# EAGLE design LED4BUS0805_v01 (EAGLE 6.5.0)
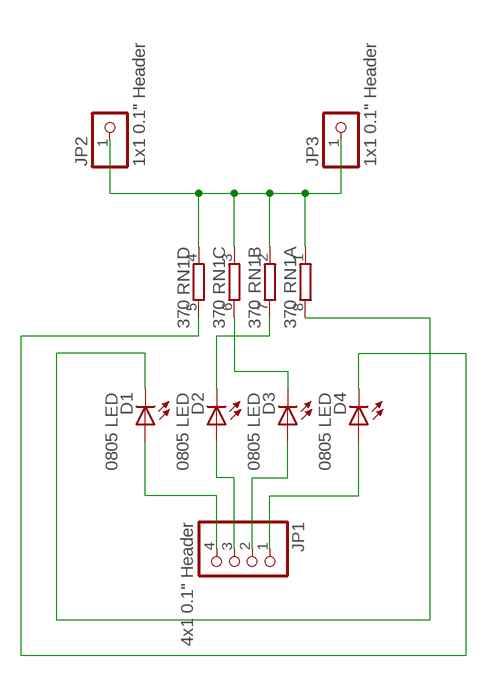
[diagram p0: schematic, sheet 1]

## Parts
D1  0805 LED  LEDCHIP-LED0805  [CHIP-LED0805]
D2  0805 LED  LEDCHIP-LED0805  [CHIP-LED0805]
D3  0805 LED  LEDCHIP-LED0805  [CHIP-LED0805]
D4  0805 LED  LEDCHIP-LED0805  [CHIP-LED0805]
JP1  4x1 0.1" Header  PINHD-1X4  [1X04]
JP2  1x1 0.1" Header  PINHD-1X1  [1X01]
JP3  1x1 0.1" Header  PINHD-1X1  [1X01]
RN1  370  4R-N0603-ARV  [0603-ARV]

## Nets
N$1: D2.A JP1.3
N$2: D3.A JP1.2
N$3: D4.A JP1.1
N$4: D1.A JP1.4
N$5: D3.C RN1.6
N$6: D2.C RN1.7
N$7: D4.C RN1.5
N$8: D1.C RN1.8
N$9: JP2.1 JP3.1 RN1.1 RN1.2 RN1.3 RN1.4

## Library data of the parts
D1-D4 = led:LED: LED OSRAM: - CHIPLED LG R971, LG N971, LY N971, LG Q971, LY Q971, LO R971, LY R971 LH N974, LH R974 LS Q976, LO Q976, LY Q976 LO Q996 - Hyper CHIPLED LW Q18S LB Q993, LB Q99A, LB R99A - SideLED LS A670, LO A670, LY A670, LG A670, LP A670 LB A673, LV A673, LT A673, LW A673 LH A674 LY A675 LS A676, LA A676, LO A676, LY A676, LW A676 LS A679, LY A679, LG A679 - Hyper Micro SIDELED® LS Y876, LA Y876, LO Y876, LY Y876 LT Y87S - SmartLED LW L88C, LW L88S LB L89C, LB L89S, LG L890 LS L89K, LO L89K, LY L89K LS L896, LA L896, LO L896, LY L896 - TOPLED LS T670, LO T670, LY T670, LG T670, LP T670 LSG T670, LSP T670, LSY T670, LOP T670, LYG T670 LG T671, LOG T671, LSG T671 LB T673, LV T673, LT T673, LW T673 LH T674 LS T676, LA T676, LO T676, LY T676, LB T676, LH T676, LSB T676, LW T676 LB T67C, LV T67C, LT T67C, LS T67K, LO T67K, LY T67K, LW E67C LS E67B, LA E67B, LO E67B, LY E67B, LB E67C, LV E67C, LT E67C LW T67C LS T679, LY T679, LG T679 LS T770, LO T770, LY T770, LG T770, LP T770 LB T773, LV T773, LT T773, LW T773 LH T774 LS E675, LA E675, LY E675, LS T675 LS T776, LA T776, LO T776, LY T776, LB T776 LHGB T686 LT T68C, LB T68C - Hyper Mini TOPLED® LB M676 - Mini TOPLED Santana® LG M470 LS M47K, LO M47K, LY M47K Source: http://www.osram.convergy.de LUXEON: - LUMILED® LXK2-PW12-R00, LXK2-PW12-S00, LXK2-PW14-U00, LXK2-PW14-V00 LXK2-PM12-R00, LXK2-PM12-S00, LXK2-PM14-U00 LXK2-PE12-Q00, LXK2-PE12-R00, LXK2-PE12-S00, LXK2-PE14-T00, LXK2-PE14-U00 LXK2-PB12-K00, LXK2-PB12-L00, LXK2-PB12-M00, LXK2-PB14-N00, LXK2-PB14-P00, LXK2-PB14-Q00 LXK2-PR12-L00, LXK2-PR12-M00, LXK2-PR14-Q00, LXK2-PR14-R00 LXK2-PD12-Q00, LXK2-PD12-R00, LXK2-PD12-S00 LXK2-PH12-R00, LXK2-PH12-S00 LXK2-PL12-P00, LXK2-PL12-Q00, LXK2-PL12-R00 Source: www.luxeon.com KINGBRIGHT: KA-3528ASYC Source: www.kingbright.com
JP1 = pinhead:PINHD-1X4: PIN HEADER
JP2 JP3 = pinhead:PINHD-1X1: PIN HEADER
RN1 = resistor-dil:4R-N: Array Chip Resistor Source: RS Component / Phycomp; OC_FARNELL: unknown; OC_NEWARK: unknown

## Board
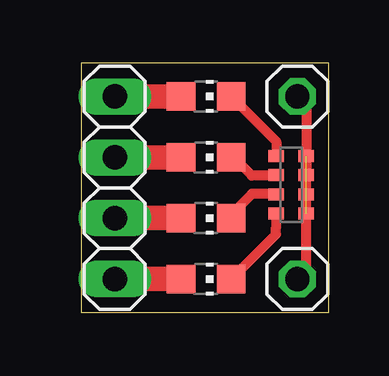
[diagram p1: board, top side]

Size 10.34 x 10.4 mm. Coordinates in mm from the lower left corner, seen from the top.
Outline: 0,0 10.34,0 10.34,10.4 0,10.4 0,0
Copper layers (1*16): Top 0.035mm / dielectric 1.5mm / Bottom 0.035mm
Design rules "default": minimum track width 10mil, minimum drill 24mil, track to track 8mil, track to pad 8mil, pad to pad 8mil, via to via 8mil, smd to smd 8mil, copper to edge 40mil, drill to drill 8mil, minimum pad ring 10mil, minimum via ring 8mil, stop-mask expansion 4mil, vias tented up to drill 0mil, thermal gap 10mil

### Footprints (pad centres in the part's own frame; a part is rotated, then mirrored left to right if it is on the bottom)
CHIP-LED0805 = smd 1.2 x 1.2: A 0,-1.05; C 0,1.05
1X04 = drill 1.016 long: 1 -3.81,0; 2 -1.27,0; 3 1.27,0; 4 3.81,0
1X01 = drill 1.016 octagon: 1 0,0
0603-ARV = smd 0.5 x 0.65: 1 -1.2,-0.625; 2 -0.4,-0.625; 3 0.4,-0.625; 4 1.2,-0.625; 5 1.2,0.625; 6 0.4,0.625; 7 -0.4,0.625; 8 -1.2,0.625

### Placement (x,y rotation side)
D1  5.21,1.4 270 top
D2  5.21,3.94 270 top
D3  5.21,6.48 270 top
D4  5.21,9.02 270 top
JP1  1.4,5.21 270 top
JP2  9.02,9.02 0 top
JP3  9.02,1.4 0 top
RN1  8.76,5.33 90 top

### Tracks (layer width: path | path; a pad name or v marks a point on that pad's centre or on a via)
N$1
  Top 1.016: JP1.3 D2.A
N$2
  Top 1.016: JP1.2 D3.A
N$3
  Top 1.016: JP1.1 D4.A
N$4
  Top 1.016: JP1.4 D1.A
N$5
  Top 0.406: RN1.6 8.12,5.71 7.11,5.71 6.35,6.48 D3.C
N$6
  Top 0.406: RN1.7 8.12,4.95 7.11,4.95 6.26,4.1
  Top 0.61: 6.26,4.1 D2.C
N$7
  Top 0.406: D4.C 8.14,7.14 RN1.5
N$8
  Top 0.406: D1.C 8.13,3.27 8.13,3.56 8.14,3.57 RN1.8
N$9  (3 unrouted)
  Top 0.406: JP2.1 9.39,8.65 RN1.3 9.39,1.77 JP3.1

### Text on the board
bNames: GingGangGooly | (c) 2013 | LED4BUS v1